# EAGLE design TinyCube15_ManualFirst (EAGLE 7.5.0)

## Sheet 1 of 2
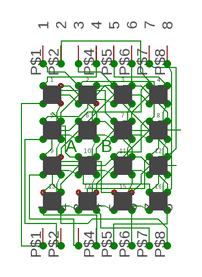
[diagram p0: schematic, sheet 1]

### Parts
1  PILLAR  [10MIL]
2  PILLAR  [10MIL]
3  PILLAR  [10MIL]
4  PILLAR  [10MIL]
5  PILLAR  [10MIL]
6  PILLAR  [10MIL]
7  PILLAR  [10MIL]
8  PILLAR  [10MIL]
9  PILLAR  [10MIL]
10  PILLAR  [10MIL]
11  PILLAR  [10MIL]
12  PILLAR  [10MIL]
13  PILLAR  [10MIL]
14  PILLAR  [10MIL]
15  PILLAR  [10MIL]
16  PILLAR  [10MIL]
U$51  TINY_HEADER_DEV  [TINY_HEADER_PKG]
U$52  TINY_HEADER_DEV  [TINY_HEADER_PKG]

### Nets
N$1: 1.R(B) 7.R(B) 12.R(B) 14.R(B) U$52.P$4
N$4: 4.B(R) 8.B(R) 12.B(R) 16.B(R) U$51.P$5
N$5: 3.B(R) 7.B(R) 11.B(R) 15.B(R) U$51.P$6
N$6: 2.B(R) 6.B(R) 10.B(R) 14.B(R) U$51.P$7
N$7: 1.+(G) 6.+(G) 11.+(G) 16.+(G) U$52.P$8
N$8: 2.R(B) 8.R(B) 11.R(B) 13.R(B) U$52.P$1
N$9: 1.G(A) 2.G(A) 3.G(A) 4.G(A) U$51.P$1
N$10: 5.G(A) 6.G(A) 7.G(A) 8.G(A) U$51.P$2
N$11: 9.G(A) 10.G(A) 11.G(A) 12.G(A) U$51.P$3
N$12: 13.G(A) 14.G(A) 15.G(A) 16.G(A) U$51.P$4
N$14: 4.R(B) 6.R(B) 9.R(B) 15.R(B) U$52.P$2
N$18: 2.+(G) 5.+(G) 12.+(G) 15.+(G) U$52.P$7
N$19: 3.+(G) 8.+(G) 9.+(G) 14.+(G) U$52.P$6
N$20: 1.B(R) 5.B(R) 9.B(R) 13.B(R) U$51.P$8
N$21: 4.+(G) 7.+(G) 10.+(G) 13.+(G) U$52.P$5
N$22: 3.R(B) 5.R(B) 10.R(B) 16.R(B) U$52.P$3

### Notes on the sheet
- A | B

## Sheet 2 of 2

## Library data of the parts
1-16 = PILLAR:PILLAR
U$51 U$52 = TinyHeader:TINY_HEADER_DEV

## Board
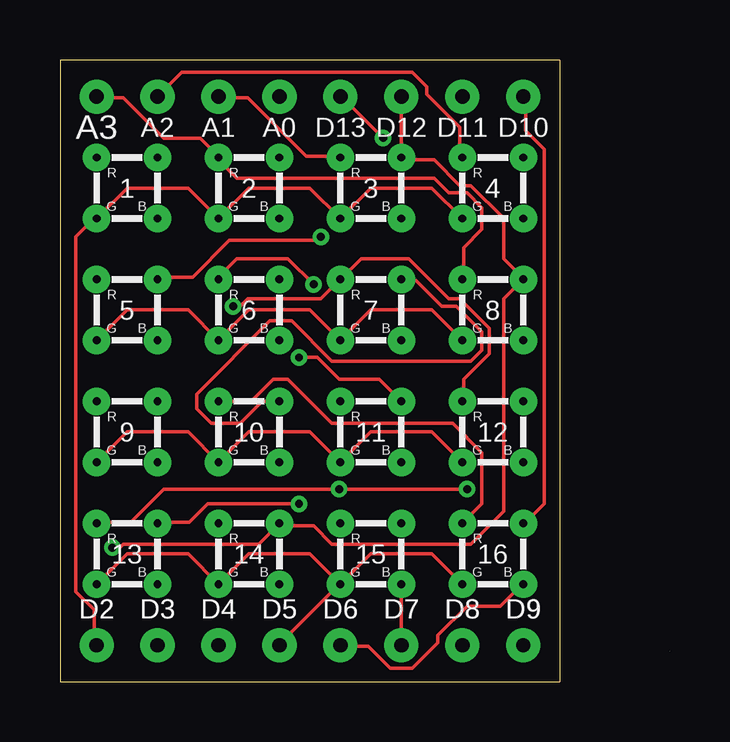
[diagram p1: board, top side]
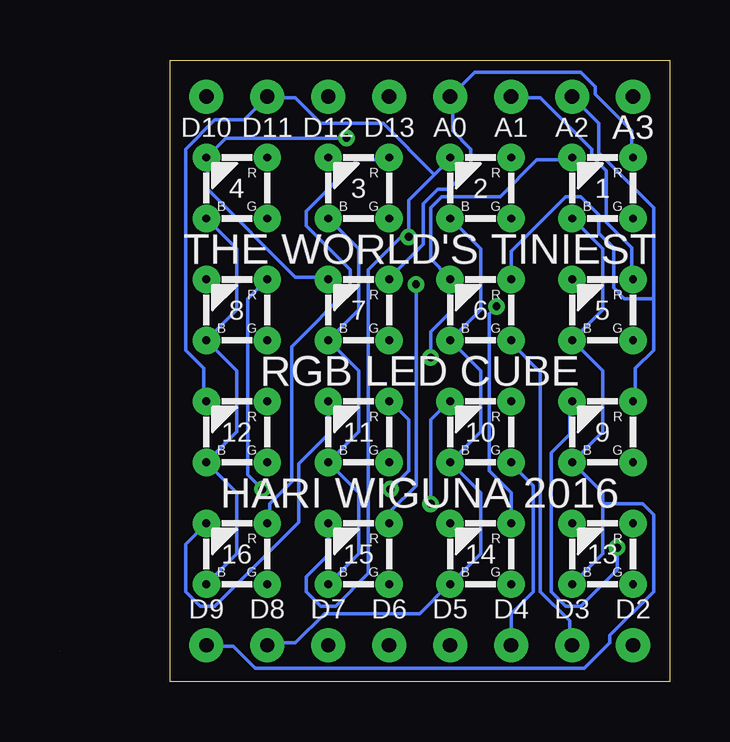
[diagram p2: board, bottom side, seen from below]

Size 25.4 x 25.91 mm. Coordinates in mm from the lower left corner, seen from the top.
Outline: 25.4,1.27 25.4,1.27
Outline: 20.83,25.91 20.83,0 0,0 0,25.91 20.83,25.91
Copper layers (1*16): Top 0.0356mm / dielectric 1.5011mm / Bottom 0.0356mm
Design rules "oshpark-2layer": minimum track width 6mil, minimum drill 13mil, track to track 6mil, track to pad 6mil, pad to pad 6mil, via to via 6mil, smd to smd 6mil, copper to edge 15mil, drill to drill 6mil, minimum pad ring 7mil, minimum via ring 7mil, stop-mask expansion 2.5mil, vias tented up to drill 0mil, thermal gap 10mil

### Footprints (pad centres in the part's own frame; a part is rotated, then mirrored left to right if it is on the bottom)
10MIL = drill 0.33 pad 1.143: + 1.27,1.27; B 1.27,-1.27; G -1.27,-1.27; R -1.27,1.27
TINY_HEADER_PKG = drill 0.6 pad 1.422: P$1 0,0; P$2 0,-2.54; P$3 0,-5.08; P$4 0,-7.62; P$5 0,-10.16; P$6 0,-12.7; P$7 0,-15.24; P$8 0,-17.78

### Placement (x,y rotation side)
1  2.79,20.57 0 top
2  7.87,20.57 0 top
3  12.95,20.57 0 top
4  18.03,20.57 0 top
5  2.79,15.49 0 top
6  7.87,15.49 0 top
7  12.95,15.49 0 top
8  18.03,15.49 0 top
9  2.79,10.41 0 top
10  7.87,10.41 0 top
11  12.95,10.41 0 top
12  18.03,10.41 0 top
13  2.79,5.33 0 top
14  7.87,5.33 0 top
15  12.95,5.33 0 top
16  18.03,5.33 0 top
U$51  1.52,1.52 90 top
U$52  1.52,24.38 90 top

### Tracks (layer width: path | path; a pad name or v marks a point on that pad's centre or on a via)
N$1  (via drill 0.33)
  Top 0.152: v7.21,15.65 7.52,15.65 7.82,15.95 10.87,15.95 7.R 12.55,17.63 14.53,17.63 16.2,15.95 16.66,15.95 17.88,14.73 17.88,13.66 16.81,12.6 16.81,11.68 12.R
  Bottom 0.152: 1.R 1.58,21.89 1.58,22.96 3.1,24.49 3.1,24.79 3.71,25.4 8.13,25.4 U$52.P$4 9.04,24.33 9.04,22.96 8.28,22.2 8.28,21.44 9.2,20.52 9.65,20.52 10.26,19.91 10.26,18.24 11.63,16.87 7.R | 14.R 6.6,7.87 7.52,8.79 7.52,15.34 v7.21,15.65
N$4
  Top 0.152: U$51.P$5 11.79,1.47 12.85,1.47 13.77,0.56 14.68,0.56 15.75,1.63 15.75,1.93 16.97,3.15 18.34,3.15 19.25,4.06 16.B
  Bottom 0.152: 4.B 18.03,18.03 18.03,15.49 8.B 18.03,12.95 18.03,10.41 12.B 18.03,7.87 18.03,5.33 16.B
N$5
  Top 0.152: 15.B U$51.P$6
  Bottom 0.152: 3.B 12.95,18.03 12.95,15.49 7.B 12.95,12.95 12.95,10.41 11.B 12.95,7.87 12.95,5.33 15.B
N$6
  Bottom 0.152: 2.B 7.87,18.03 7.87,15.49 6.B 7.87,12.95 7.87,10.41 10.B 7.87,7.87 7.87,5.33 14.B 9.2,4.06 10.41,2.85 14.38,2.85 15.6,1.63 16.66,1.63 U$51.P$7
N$7  (via drill 0.33)
  Top 0.152: U$52.P$8 19.41,24.33 19.41,22.96 20.17,22.2 20.17,7.42 19.41,6.65 16.+ | v9.96,13.51 10.72,13.51 11.63,12.6 13.31,12.6 11.+
  Bottom 0.152: 1.+ 4.17,21.74 5.54,21.74 7.06,20.22 9.5,20.22 9.96,19.76 9.96,17.63 9.2,16.87 6.+ 9.2,16.71 9.2,15.34 9.96,14.58 v9.96,13.51 | 11.+ 14.22,10.31 15.44,9.09 15.44,6.65 18.95,3.15 19.56,3.15 20.17,3.76 20.17,5.74 16.+
N$8  (via drill 0.33)
  Top 0.152: 13.R 1.58,6.65 2.95,6.65 4.32,8.03 v11.63,8.03 v16.97,8.03 | 8.R 16.81,16.87 16.81,18.09 17.58,18.85 17.58,19.76 16.97,20.37 16.2,20.37 15.6,20.98 7.37,20.98 6.6,21.74 2.R 6.6,21.89 5.84,22.66 4.32,22.66 2.64,24.33 1.58,24.33 U$52.P$1
  Bottom 0.152: v11.63,8.03 10.87,8.79 10.87,10.92 11.63,11.68 11.R | v16.97,8.03 17.58,8.64 17.58,15.95 8.R
N$9
  Top 0.152: 4.G 15.49,20.57 12.95,20.57 3.G 10.41,20.57 7.87,20.57 2.G 5.33,20.57 2.79,20.57 1.G 1.42,19.3 0.66,18.54 0.66,3.76 1.42,3 1.42,1.63 U$51.P$1
N$10
  Top 0.152: 5.G 2.79,15.49 5.33,15.49 6.G 7.87,15.49 10.41,15.49 7.G 12.95,15.49 15.49,15.49 8.G
  Bottom 0.152: U$51.P$2 4.17,1.63 4.17,2.54 5.38,3.76 5.38,12.9 6.6,14.12 6.G
N$11
  Top 0.152: 9.G 2.79,10.41 5.33,10.41 10.G 7.87,10.41 10.41,10.41 11.G 12.95,10.41 15.49,10.41 12.G
  Bottom 0.152: U$51.P$3 6.6,2.85 5.69,3.76 5.69,8.18 6.6,9.09 10.G
N$12
  Top 0.152: 13.G 2.79,5.33 5.33,5.33 14.G 7.87,5.33 10.41,5.33 15.G | 16.G 15.49,5.33 12.95,5.33 15.G | U$51.P$4 9.2,1.63 11.63,4.06 15.G
N$14  (via drill 0.33)
  Top 0.152: v10.57,16.56 9.5,17.63 7.37,17.63 6.6,16.87 6.R | U$52.P$2 5.08,25.4 14.68,25.4 15.29,24.79 15.29,24.49 16.66,23.11 16.66,21.89 4.R
  Bottom 0.152: 0.66,15.95 0.66,19.76 2.95,22.05 2.95,23.27 U$52.P$2 | 0.66,15.95 0.66,13.82 1.42,13.06 1.42,11.68 9.R | 6.R 6.6,17.93 4.32,20.22 3.71,20.22 2.95,19.46 2.95,18.69 2.34,18.09 2.34,16.41 1.88,15.95 0.66,15.95 | v10.57,16.56 10.57,8.18 11.63,7.11 11.63,6.65 15.R
N$18  (via drill 0.33)
  Top 0.152: v10.87,18.54 10.72,18.39 7.06,18.39 5.54,16.87 4.17,16.87 5.+
  Bottom 0.152: 12.+ 19.41,11.68 19.41,13.06 20.17,13.82 20.17,22.2 18.95,23.42 17.73,23.42 U$52.P$7 16.66,24.33 15.6,24.33 14.53,23.27 11.94,23.27 9.8,21.13 | 10.87,18.85 10.87,20.07 9.8,21.13 | 9.8,21.13 9.2,21.74 2.+ | 15.+ 14.22,5.28 15.14,4.37 15.14,3.76 14.53,3.15 13.92,3.15 12.55,4.52 12.55,17.17 10.87,18.85 | 10.87,18.85 v10.87,18.54
N$19  (via drill 0.33)
  Top 0.152: U$52.P$6 3.+ 14.22,21.74 15.6,21.74 16.66,20.68 17.12,20.68 18.49,19.3 18.49,17.63 19.25,16.87 8.+ 18.49,15.95 18.49,7.11 17.12,5.74 11.33,5.74 10.57,6.5 9.2,6.5 14.+ 8.28,5.74 2.64,5.74 2.49,5.59 v2.18,5.59
  Bottom 0.152: v2.18,5.59 2.18,4.67 3.71,3.15 4.32,3.15 4.93,3.76 4.93,9.55 4.17,10.31 4.17,11.68 9.+
N$20
  Bottom 0.152: 1.B 2.79,18.03 2.79,15.49 5.B 2.79,12.95 2.79,10.41 9.B 2.79,7.87 2.79,7.42 | 2.79,7.42 2.79,5.33 13.B | 2.79,7.42 1.12,7.42 0.66,6.96 0.66,3.76 2.49,1.93 2.49,1.63 3.56,0.56 17.27,0.56 18.19,1.47 19.25,1.47 U$51.P$8
N$21  (via drill 0.33)
  Top 0.152: v9.96,7.42 6.15,7.42 5.38,6.65 4.17,6.65 13.+ | v13.46,22.66 11.79,24.33 U$52.P$5 | 10.+ 8.43,11.68 7.52,10.77 6.3,10.77 5.69,11.38 5.69,11.99 8.74,15.04 9.65,15.04 11.33,13.36 17.12,13.36 17.58,13.82 17.58,14.58 16.51,15.65 15.9,15.65 14.83,16.71 14.22,16.71 7.+
  Bottom 0.152: v9.96,7.42 9.96,10.92 9.2,11.68 10.+ | 7.+ 14.22,16.87 15.6,16.87 19.25,20.52 19.25,21.74 4.+ 18.49,22.66 v13.46,22.66
N$22
  Top 0.152: 10.R 7.98,11.68 8.89,12.6 9.5,12.6 11.33,10.77 16.36,10.77 17.58,9.55 17.58,7.42 16.R | 3.R 11.63,21.89 10.26,21.89 7.82,24.33 6.6,24.33 U$52.P$3
  Bottom 0.152: 5.R 1.58,16.87 1.58,18.09 2.64,19.15 2.64,21.29 3.25,21.89 3.25,22.2 5.38,24.33 6.6,24.33 U$52.P$3 | 16.R 16.66,6.65 16.66,7.42 15.75,8.33 15.75,13.97 13.31,16.41 13.31,17.17 15.14,19 15.14,19.61 13.01,21.74 11.79,21.74 3.R

### Text on the board
bPlace: THE WORLD'S TINIEST | RGB LED CUBE | HARI WIGUNA 2016
tNames: A3 | A2 | A1 | A0 | D13 | D12 | D11 | D10 | D2 | D2 | D3 | D3 | D4 | D4 | D5 | D5 | D6 | D6 | D7 | D7 | D8 | D8 | D9 | D9
bNames: A3 | A2 | A1 | A0 | D13 | D12 | D11 | D10 | D2 | D3 | D4 | D5 | D6 | D7 | D8 | D9